# Altium schematic sheet monitor_waterpressure.SchDoc: Monitor of waterpressure
size A3; Author: Zhou; CompanyName: 浙江大学台州研究院机电所; DrawnBy: Zhou; Engineer: Zhou
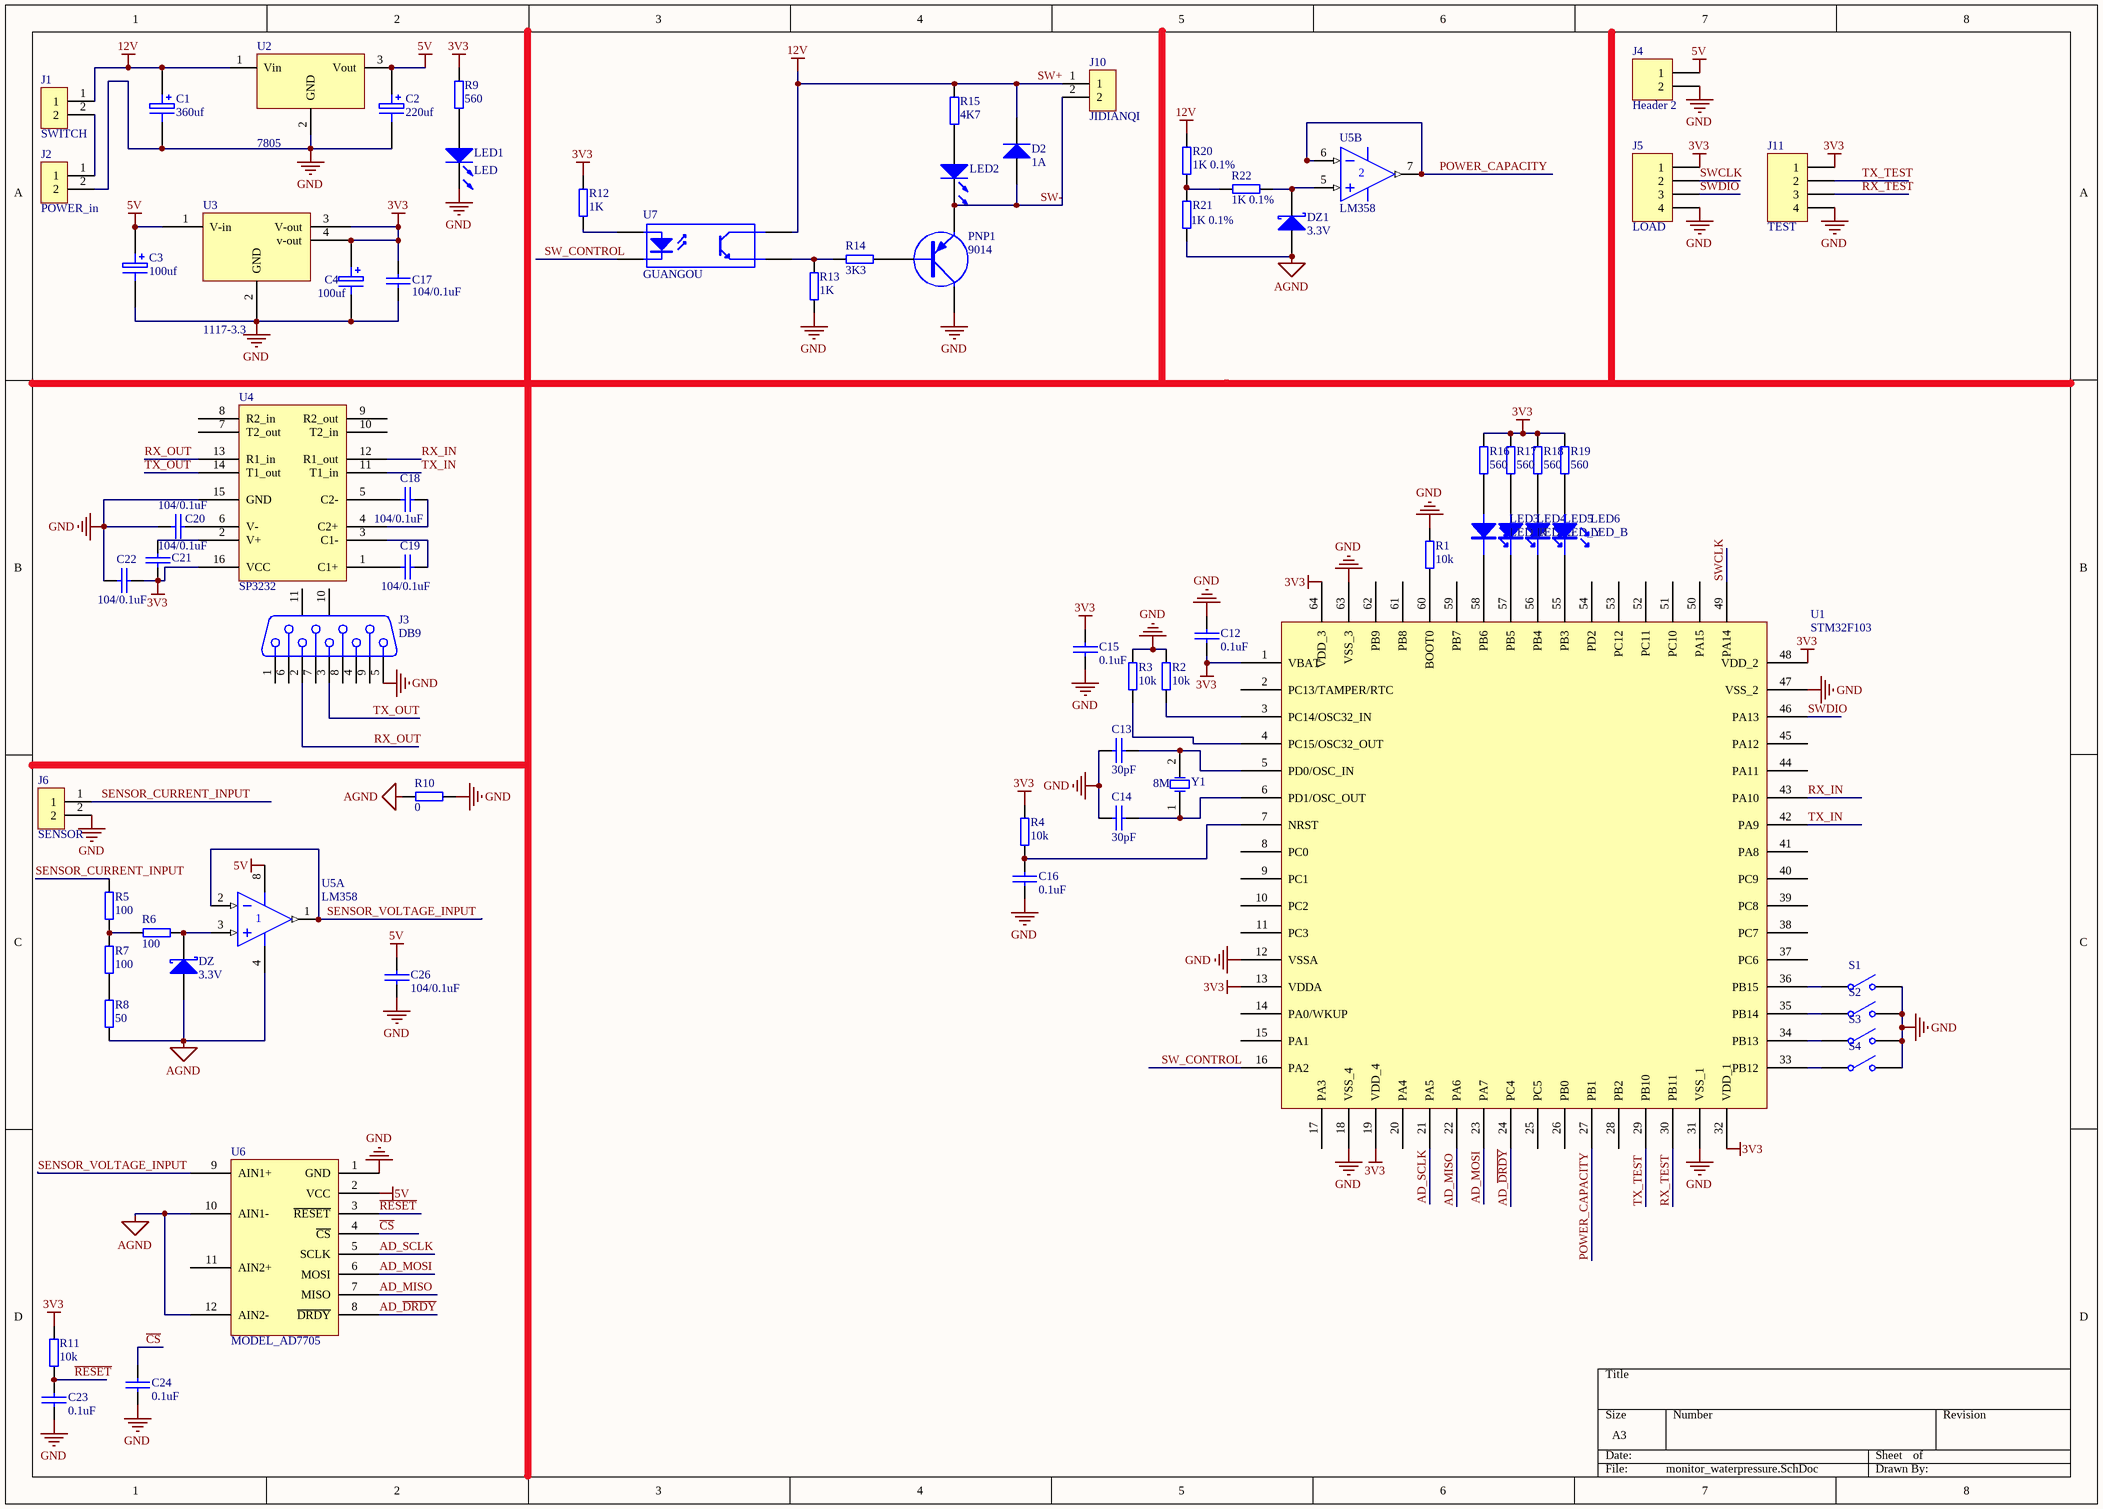
[diagram p0: monitor_waterpressure.SchDoc]

## Parts
C1  360uf  [RAD-200-1]
C2  220uf  [RAD-200-1]
C3  100uf  [RAD-200-1]
C4  100uf  [RAD-200-1]
C12  0.1uF  [0805]
C13  30pF  [0805]
C14  30pF  [0805]
C15  0.1uF  [0805]
C16  0.1uF  [0805]
C17  104/0.1uF  [0805]
C18  104/0.1uF  [0805]
C19  104/0.1uF  [0805]
C20  104/0.1uF  [0805]
C21  104/0.1uF  [0805]
C22  104/0.1uF  [0805]
C23  0.1uF  [0805]
C24  0.1uF  [0805]
C26  104/0.1uF  [0805]
D2  1A  [ERJIGUAN-1.1MM]
DZ  3.3V  [ERJIGUAN-5]
DZ1  3.3V  [ERJIGUAN-5]
J1  SWITCH  [CON2_7.62MM]
J2  POWER_in  [CON2-100mil-XH]
J3  DB9  [DB9]
J4  Header 2  [HDR1X2]
J5  LOAD  [HDR1X4]
J6  SENSOR  [CON2-200]
J10  JIDIANQI  [CN2_S]
J11  TEST  [HDR1X4]
LED1  LED  [LED-0805]
LED2  LED-AK  [LED-0805]  (value not drawn)
LED3  LED_R  [LED-0805]
LED4  LED_G  [LED-0805]
LED5  LED_Y  [LED-0805]
LED6  LED_B  [LED-0805]
PNP1  9014  [PNP]
R1  10k  [0805]
R2  10k  [0805]
R3  10k  [0805]
R4  10k  [0805]
R5  100  [0805]
R6  100  [0805]
R7  100  [0805]
R8  50  [0805]
R9  560  [0805]
R10  0  [0805]
R11  10k  [0805]
R12  1K  [0805]
R13  1K  [0805]
R14  3K3  [0805]
R15  4K7  [0805]
R16  560  [0805]
R17  560  [0805]
R18  560  [0805]
R19  560  [0805]
R20  1K 0.1%  [0805]
R21  1K 0.1%  [0805]
R22  1K 0.1%  [0805]
S1  SW-SPST  [SW_SPST]  (value not drawn)
S2  SW-SPST  [SW_SPST]  (value not drawn)
S3  SW-SPST  [SW_SPST]  (value not drawn)
S4  SW-SPST  [SW_SPST]  (value not drawn)
U1  STM32F103  [LQFP-64]
U2  7805  [TO220]
U3  1117-3.3  [lm1117-3.3]
U4  SP3232  [SO-16]
U5  LM358  [SO-8]  (parts A,B of 2)
U6  MODEL_AD7705
U7  GUANGOU  [TLP521]
Y1  8M  [XTAL1]

## Nets
3V3: C4.1 C12.2 C15.1 C17.1 C21.1 C22.2 J5.1 J11.1 R4.2 R9.2 R11.2 R12.2 R16.1 R17.1 R18.2 R19.2 U1.1(VBAT) U1.13(VDDA) U1.19(VDD_4) U1.32(VDD_1) U1.48(VDD_2) U1.64(VDD_3) U3.3(V-out) U3.4(v-out) U4.16(VCC)
5V: C2.1 C3.1 C26.1 J4.1 U2.3(Vout) U3.1(V-in) U5.8(V+) U6.2(VCC)
AGND: DZ.1(A) DZ1.1(A) R8.1 R10.2 R21.1 U5.4(V-) U6.10(AIN1-) U6.12(AIN2-)
GND: C1.2 C2.2 C3.2 C4.2 C12.1 C13.1 C14.1 C15.2 C16.2 C17.2 C20.1 C22.1 C23.2 C24.2 C26.2 J2.2 J3.5 J4.2 J5.4 J6.2 J11.4 LED1.K PNP1.3(C) R1.2 R2.2 R3.2 R10.1 R13.1 S1.2(NO) S2.2(NO) S3.2(NO) S4.2(NO) U1.12(VSSA) U1.18(VSS_4) U1.31(VSS_1) U1.47(VSS_2) U1.63(VSS_3) U2.2(GND) U3.2(GND) U4.15(GND) U6.1(GND)
SW+: C1.1 D2.2 J1.1 J10.1 R15.2 R20.2 U2.1(Vin) U7.4(C)  [also labelled 12V]
AD_~{DRDY}: U1.24(PC4) U6.8(~{DRDY})
AD_MISO: U1.22(PA6) U6.7(MISO)
AD_MOSI: U1.23(PA7) U6.6(MOSI)
AD_SCLK: U1.21(PA5) U6.5(SCLK)
~{CS}: C24.1 U6.4(~{CS})
POWER_CAPACITY: U1.27(PB1) U5.6(IN-) U5.7(OUT)
~{RESET}: C23.1 R11.1 U6.3(~{RESET})
RX_IN: U1.43(PA10) U4.12(R1_out)
RX_OUT: J3.2 U4.13(R1_in)
RX_TEST: J11.3 U1.30(PB11)
SENSOR_CURRENT_INPUT: J6.1 R5.2
SENSOR_VOLTAGE_INPUT: U5.1 U5.2(IN-) U6.9(AIN1+)
SW-: D2.1 J10.2 LED2.K PNP1.2(E)
SW_CONTROL: U1.16(PA2) U7.2(K)
SWCLK: J5.2 U1.49(PA14)
SWDIO: J5.3 U1.46(PA13)
TX_IN: U1.42(PA9) U4.11(T1_in)
TX_OUT: J3.3 U4.14(T1_out)
TX_TEST: J11.2 U1.29(PB10)
NetC13_2: C13.2 U1.5(PD0/OSC_IN) Y1.2(OSC2)
NetC14_2: C14.2 U1.6(PD1/OSC_OUT) Y1.1(OSC1)
NetC16_1: C16.1 R4.1 U1.7(NRST)
NetC18_1: C18.1 U4.5(C2-)
NetC18_2: C18.2 U4.4(C2+)
NetC19_1: C19.1 U4.1(C1+)
NetC19_2: C19.2 U4.3(C1-)
NetC20_2: C20.2 U4.6(V-)
NetC21_2: C21.2 U4.2(V+)
NetDZ1_2: DZ1.2(K) R22.2 U5.5(IN+)
NetDZ_2: DZ.2(K) R6.2 U5.3(IN+)
NetJ1_2: J1.2 J2.1
NetLED1_A: LED1.A R9.1
NetLED2_A: LED2.A R15.1
NetLED3_A: LED3.A R16.2
NetLED3_K: LED3.K U1.58(PB6)
NetLED4_A: LED4.A R17.2
NetLED4_K: LED4.K U1.57(PB5)
NetLED5_A: LED5.A R18.1
NetLED5_K: LED5.K U1.56(PB4)
NetLED6_A: LED6.A R19.1
NetLED6_K: LED6.K U1.55(PB3)
NetPNP1_1: PNP1.1(B) R14.1
NetR1_1: R1.1 U1.60(BOOT0)
NetR2_1: R2.1 U1.3(PC14/OSC32_IN)
NetR3_1: R3.1 U1.4(PC15/OSC32_OUT)
NetR5_1: R5.1 R6.1 R7.2
NetR7_1: R7.1 R8.2
NetR12_1: R12.1 U7.1(A)
NetR13_2: R13.2 R14.2 U7.3(E)
NetR20_1: R20.1 R21.2 R22.1
NetS1_1: S1.1(COMMON) U1.36(PB15)
NetS2_1: S2.1(COMMON) U1.35(PB14)
NetS3_1: S3.1(COMMON) U1.34(PB13)
NetS4_1: S4.1(COMMON) U1.33(PB12)

Not connected (* = marked no-connect by the designer): J3 1 4 6 7 8 9 10(MH1) 11(MH2); U1 2(PC13/TAMPER/RTC) 8(PC0) 9(PC1) 10(PC2) 11(PC3) 14(PA0/WKUP) 15(PA1) 17(PA3) 20(PA4) 25(PC5) 26(PB0) 28(PB2) 37(PC6) 38(PC7) 39(PC8) 40(PC9) 41(PA8) 44(PA11) 45(PA12) 50(PA15) 51(PC10) 52(PC11) 53(PC12) 54(PD2) 59(PB7) 61(PB8) 62(PB9); U4 7(T2_out) 8(R2_in) 9(R2_out) 10(T2_in); U6 11(AIN2+)

## Library data of the parts
C1-C4 = ELECTRO1: Electrolytic Capacitor
C12-C24 C26 = cap
D2 = DIODE
DZ DZ1 = Diode_DZ: Schottky Rectifier; Note: Terminal 2 is the TAB and is electrically connected to the cathode; Published: 8-Jun-2000; LatestRevisionDate: 17-Jul-2002; LatestRevisionNote: Re-released for DXP Platform.; DatasheetVersion: Dec-1997; PackageVersion: Feb-1998; PackageReference: TO-220AC; Publisher: Altium Limited; ComponentLink1Description: Manufacturer Link; ComponentLink1URL: http://www.irf.com/; ComponentLink2Description: Datasheet; ComponentLink2URL: http://www.irf.com/product-info/datasheets/data/18tq.pdf
J1 J2 J6 J10 = CON2
J4 = Header 2: Header, 2-Pin; LatestRevisionDate: 17-Jul-2002; LatestRevisionNote: Re-released for DXP Platform.; Publisher: Altium Limited
J5 J11 = Header 4: Header, 4-Pin; LatestRevisionDate: 17-Jul-2002; LatestRevisionNote: Re-released for DXP Platform.; Publisher: Altium Limited
LED2-LED6 = LED
  LED2: Published: 8-Jun-2000; LatestRevisionDate: 08-Jul-2005; LatestRevisionNote: Mech Layer 1 removed.; PackageReference: LED-1; Publisher: Altium Limited; PackageDescription: 100mil.
PNP1 = PNP_123
R1-R22 = RES2-2
S1-S4 = SW-SPST: Single-Pole, Single-Throw Switch; Published: 24-Mar-1999; LatestRevisionDate: 17-Jul-2002; LatestRevisionNote: Re-released for DXP Platform.; PackageReference: SPST-2; Publisher: Altium Limited; PackageDescription: Switch; 2 Leads
U4 = MAX232: U
Y1 = 晶振
LED1 = LED: Published: 8-Jun-2000; LatestRevisionDate: 08-Jul-2005; LatestRevisionNote: Mech Layer 1 removed.; PackageReference: LED-1; Publisher: Altium Limited; PackageDescription: 100mil.